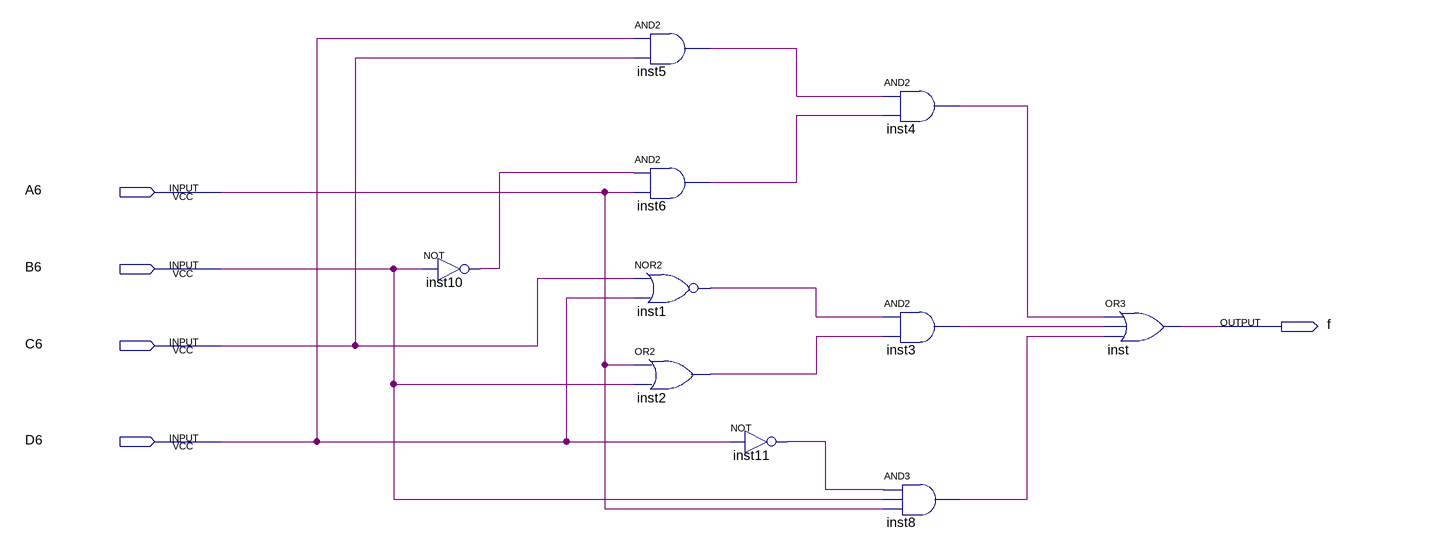
[diagram p0: schematic sheet]
// Quartus schematic Segment_f.bdf as structural Verilog: 10 symbols, 5 pins
module Segment_f (
  input  A6,
  input  B6,
  input  C6,
  input  D6,
  output f
);

  wire inst1_out, inst2_out, inst3_out, inst4_out, inst5_out, inst6_out, inst8_out, inst10_out, inst11_out;

  not inst10 (inst10_out, B6);
  and inst5 (inst5_out, D6, C6);
  and inst6 (inst6_out, inst10_out, A6);
  nor inst1 (inst1_out, C6, D6);
  or inst2 (inst2_out, A6, B6);
  not inst11 (inst11_out, D6);
  and inst4 (inst4_out, inst5_out, inst6_out);
  and inst3 (inst3_out, inst1_out, inst2_out);
  and inst8 (inst8_out, inst11_out, B6, A6);
  or inst (f, inst4_out, inst3_out, inst8_out);
endmodule
